# EAGLE schematic lc-meter-lm311 (EAGLE 5.07)
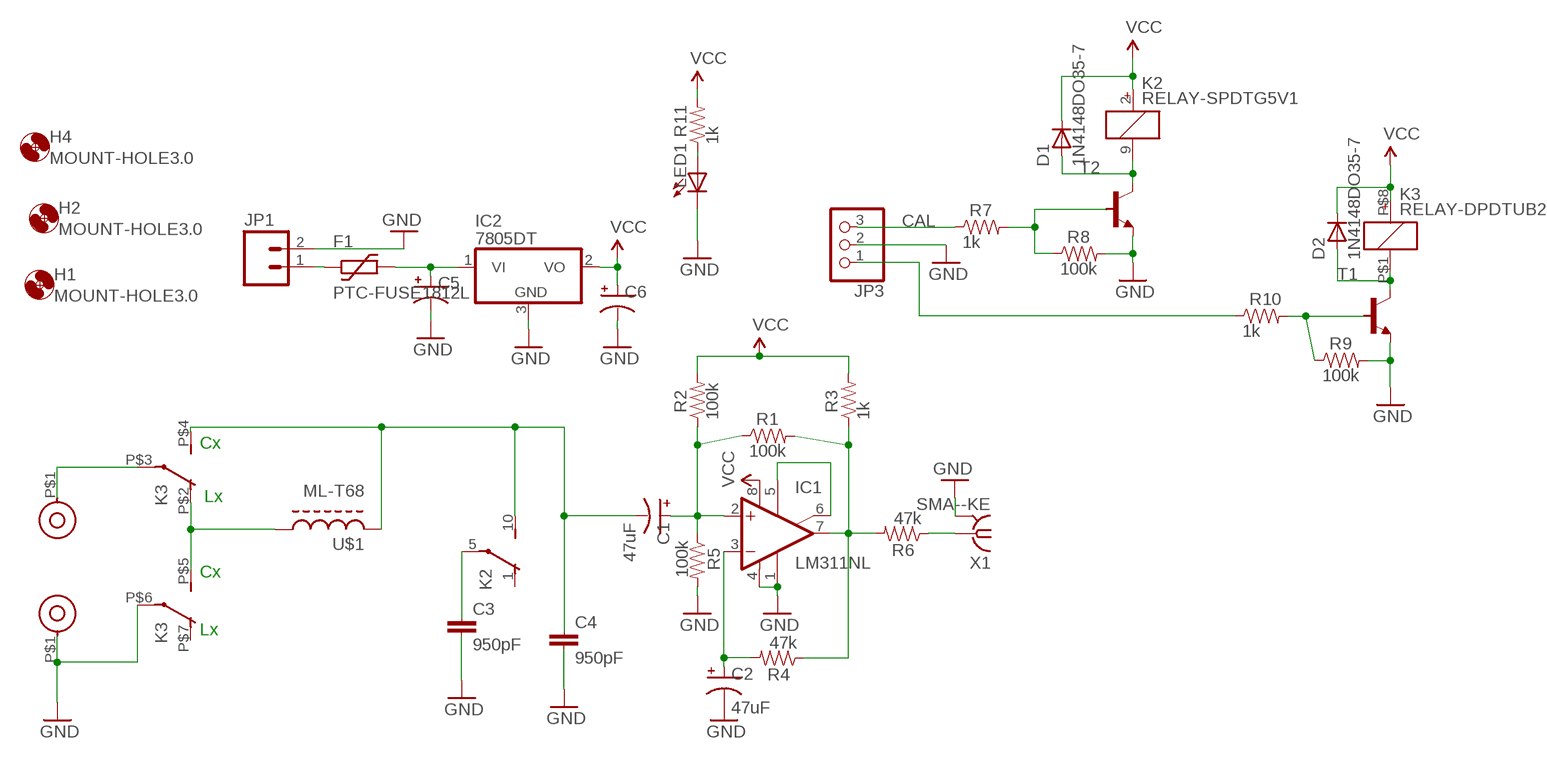
[diagram p0: schematic, sheet 1]

## Parts
C1  47uF  CAP_POL-CT6032  [CT6032]
C2  47uF  CAP_POL-CT6032  [CT6032]
C3  950pF  CAP-CB  [CB-1.3CM]
C4  950pF  CAP-CB  [CB-1.3CM]
C5  CAP_POL-CT6032  [CT6032]
C6  CAP_POL-CT6032  [CT6032]
D1  1N4148DO35-7  DIODE1206  [1206-DIODE]
D2  1N4148DO35-7  DIODE1206  [1206-DIODE]
F1  PTC-FUSE1812L  [1812L]
H1  MOUNT-HOLE3.0  [3,0]
H2  MOUNT-HOLE3.0  [3,0]
H4  MOUNT-HOLE3.0  [3,0]
IC1  LM311NL  [DIL-08]
IC2  7805DT  [TO252]
JP1  CON-02XH-V  [XH-1X2-LONG-LOCK-V]
JP3  PINHD-1X3PTH  [1X03]
K2  RELAY-SPDTG5V1  [G5V1]
K3  RELAY-DPDTUB2  [UB2-NU]
LED1  LED0805  [CHIPLED_0805]
R1  100k  RESISTOR-R0805W  [R0805W]
R2  100k  RESISTOR-R0805W  [R0805W]
R3  1k  RESISTOR-R0805W  [R0805W]
R4  47k  RESISTOR-R0805W  [R0805W]
R5  100k  RESISTOR-R0805W  [R0805W]
R6  47k  RESISTOR-R0805W  [R0805W]
R7  1k  RESISTOR-R0805W  [R0805W]
R8  100k  RESISTOR-R0805W  [R0805W]
R9  100k  RESISTOR-R0805W  [R0805W]
R10  1k  RESISTOR-R0805W  [R0805W]
R11  1k  RESISTOR-R0805W  [R0805W]
T1  -NPN-SOT23-BEC  [SOT23-BEC]
T2  -NPN-SOT23-BEC  [SOT23-BEC]
U$1  ML-T68  [T68-PIN2]
U$2  SOCK  [SOCK-5MM]
U$4  SOCK  [SOCK-5MM]
X1  SMA--KE  [SMA-KE]

## Nets
CAL: JP3.3 R7.1
GND: C2.- C3.2 C4.2 C5.- C6.- IC1.1(GND) IC1.4(V-) IC2.3(GND) JP1.2 JP3.2 K3.P$6(-2:P) LED1.C R5.2 R8.2 R9.2 T1.E T2.E U$2.P$1 X1.G@1(GND)
N$1: K3.P$3(-1:P) U$4.P$1
N$2: C1.+ IC1.2(+IN) R1.1 R2.1 R5.1
N$3: C2.+ IC1.3(-IN) R4.2
N$4: IC1.7(OUT) R1.2 R3.1 R4.1 R6.2
N$5: IC1.5(ON) IC1.6(ON/STR)
N$6: D2.A K3.P$1 T1.C
N$7: C3.1 K2.5(2:P)
N$8: C1.- C4.1 K2.10(2:S) K3.P$4(-1:S) U$1.4
N$9: R6.1 X1.1
N$10: D1.A K2.9 T2.C
N$11: R7.2 R8.1 T2.B
N$12: K3.P$2(-1:O) K3.P$5(-2:S) U$1.3
N$13: F1.P$1 JP1.1
N$14: C5.+ F1.P$2 IC2.1(VI)
N$15: R9.1 R10.2 T1.B
N$16: JP3.1 R10.1
N$17: LED1.A R11.1
VCC: C6.+ D1.K(C) D2.K(C) IC1.8(V+) IC2.2(VO) K2.2 K3.P$8 R2.2 R3.2 R11.2
Unconnected: K2.1(2:O) K3.P$7(-2:O)

## Notes on the sheet
- Cx
- Lx
- Cx
- Lx

## Power pins joined to a net without a drawn wire
GND: X1.G@2(GND) X1.G@3(GND) X1.G@4(GND)

## Library data of the parts
C1 C2 C5 C6 = digital-toy:CAP_POL: Capacitor Polarized These are standard SMD and PTH capacitors. Normally 10uF, 47uF, and 100uF in electrolytic and tantalum varieties. Always verify the external diameter of the through hole cap, it varies with capacity, voltage, and manufacturer. The EIA devices should be standard. PANASONIC_D size: 6.5mmx6.5mmx5.5mm, 100uf (taobao:6.3mmx5.5mm), same as CVL0605 153cvl0405 size: 4mmx4mmx5.5mm, 10uf (taobao:4mmx5.5mm) ct6032 typical 47uF Tantalum, comment by hyl.
C3 C4 = digital-toy:CAP: Capacitor Standard 0603 ceramic capacitor, and 0.1" leaded capacitor.
D1 D2 = digital-toy:DIODE: Diode These are standard reverse protection diodes and small signal diodes. SMA package can handle up to about 1A. SOD-323 can handle about 200mA. What the SOD-323 package when ordering, there are some mfgs out there that are 5-pin packages.
F1 = digital-toy:PTC-FUSE
H1 H2 H4 = holes:MOUNT-HOLE: MOUNTING HOLE with drill center marker
IC1 = digital-toy:LM311: COMPARATOR
IC2 = linear:78*: Positive VOLTAGE REGULATOR Source: http://cache.national.com/ds/LM/LM78L05.pdf http://www.fairchildsemi.com/ds/LM/LM7805.pdf
JP1 = digital-toy:CON-02: Header 2 Standard 2-pin 0.1" header. Use with straight break away headers (SKU : PRT-00116), right angle break away headers (PRT-00553), swiss pins (PRT-00743), machine pins (PRT-00117), and female headers (PRT-00115). Molex polarized connector foot print use with SKU : PRT-08233 with associated crimp pins and housings.
JP3 = digital-toy:PINHD-1X3: PIN HEADER
K2 = digital-toy:RELAY-SPDT: Miniature Power PCB Relay SCHRACK 1pole 10 A Source: http://www.schrack.com/.. 5847.pdf
K3 = digital-toy:RELAY-DPDT: Note NEC coil has polarity KLEIN RELAIS WASCHDICHT 2 Wechsler Distriibutor: Conrad Electronic, Bestell Nr.: 505226-13 - 24V 505226-13 - 5V 505170-13 - 12V 505170-13 - 48V Bestar Electric Ltd. Source: http://www2.produktinfo.conrad.com/datenblaetter/500000-524999/505226-da-01-en-Kleinrelais_waschdicht_24V.pdf
LED1 = digital-toy:LED: LEDs Standard schematic elements and footprints for 5mm, 3mm, 1206, and 0603 sized LEDs. 5mm - Spark Fun Electronics SKU : COM-00529 (and others) copy led.lbr 0805 led here, by hyl digital-toy. 2010.6.29
R1-R11 = digital-toy:RESISTOR: Resistor Basic schematic elements and footprints for 0603, 1206, and PTH 1/10th watt (small) resistors. digital-toy copy vertical mount of axial-0.3 from rcl.lbr : the 0207/xx 3W resistor: 0617/17, 0617/22, 0617V
T1 T2 = digital-toy:*-NPN-: NPN Transistror most of sot-23 use the pacages sot23-BEC, top C, left B, right E. by hyl, digital-toy. and to-92 use ebc(from-top) by hyl, digital-toy.
U$1 = dtoy-RF:ML
U$2 U$4 = digital-toy:SOCK
X1 = dtoy-RF:SMA-: SMA 50 Ohm End Launch Jack Receptacle - Round Contact Johnson Components Source: www.johnsoncomponents.com .. J502-ND.pdf